# EAGLE schematic BalconyLight (EAGLE 9.3.1)

## Sheet 1 of 4
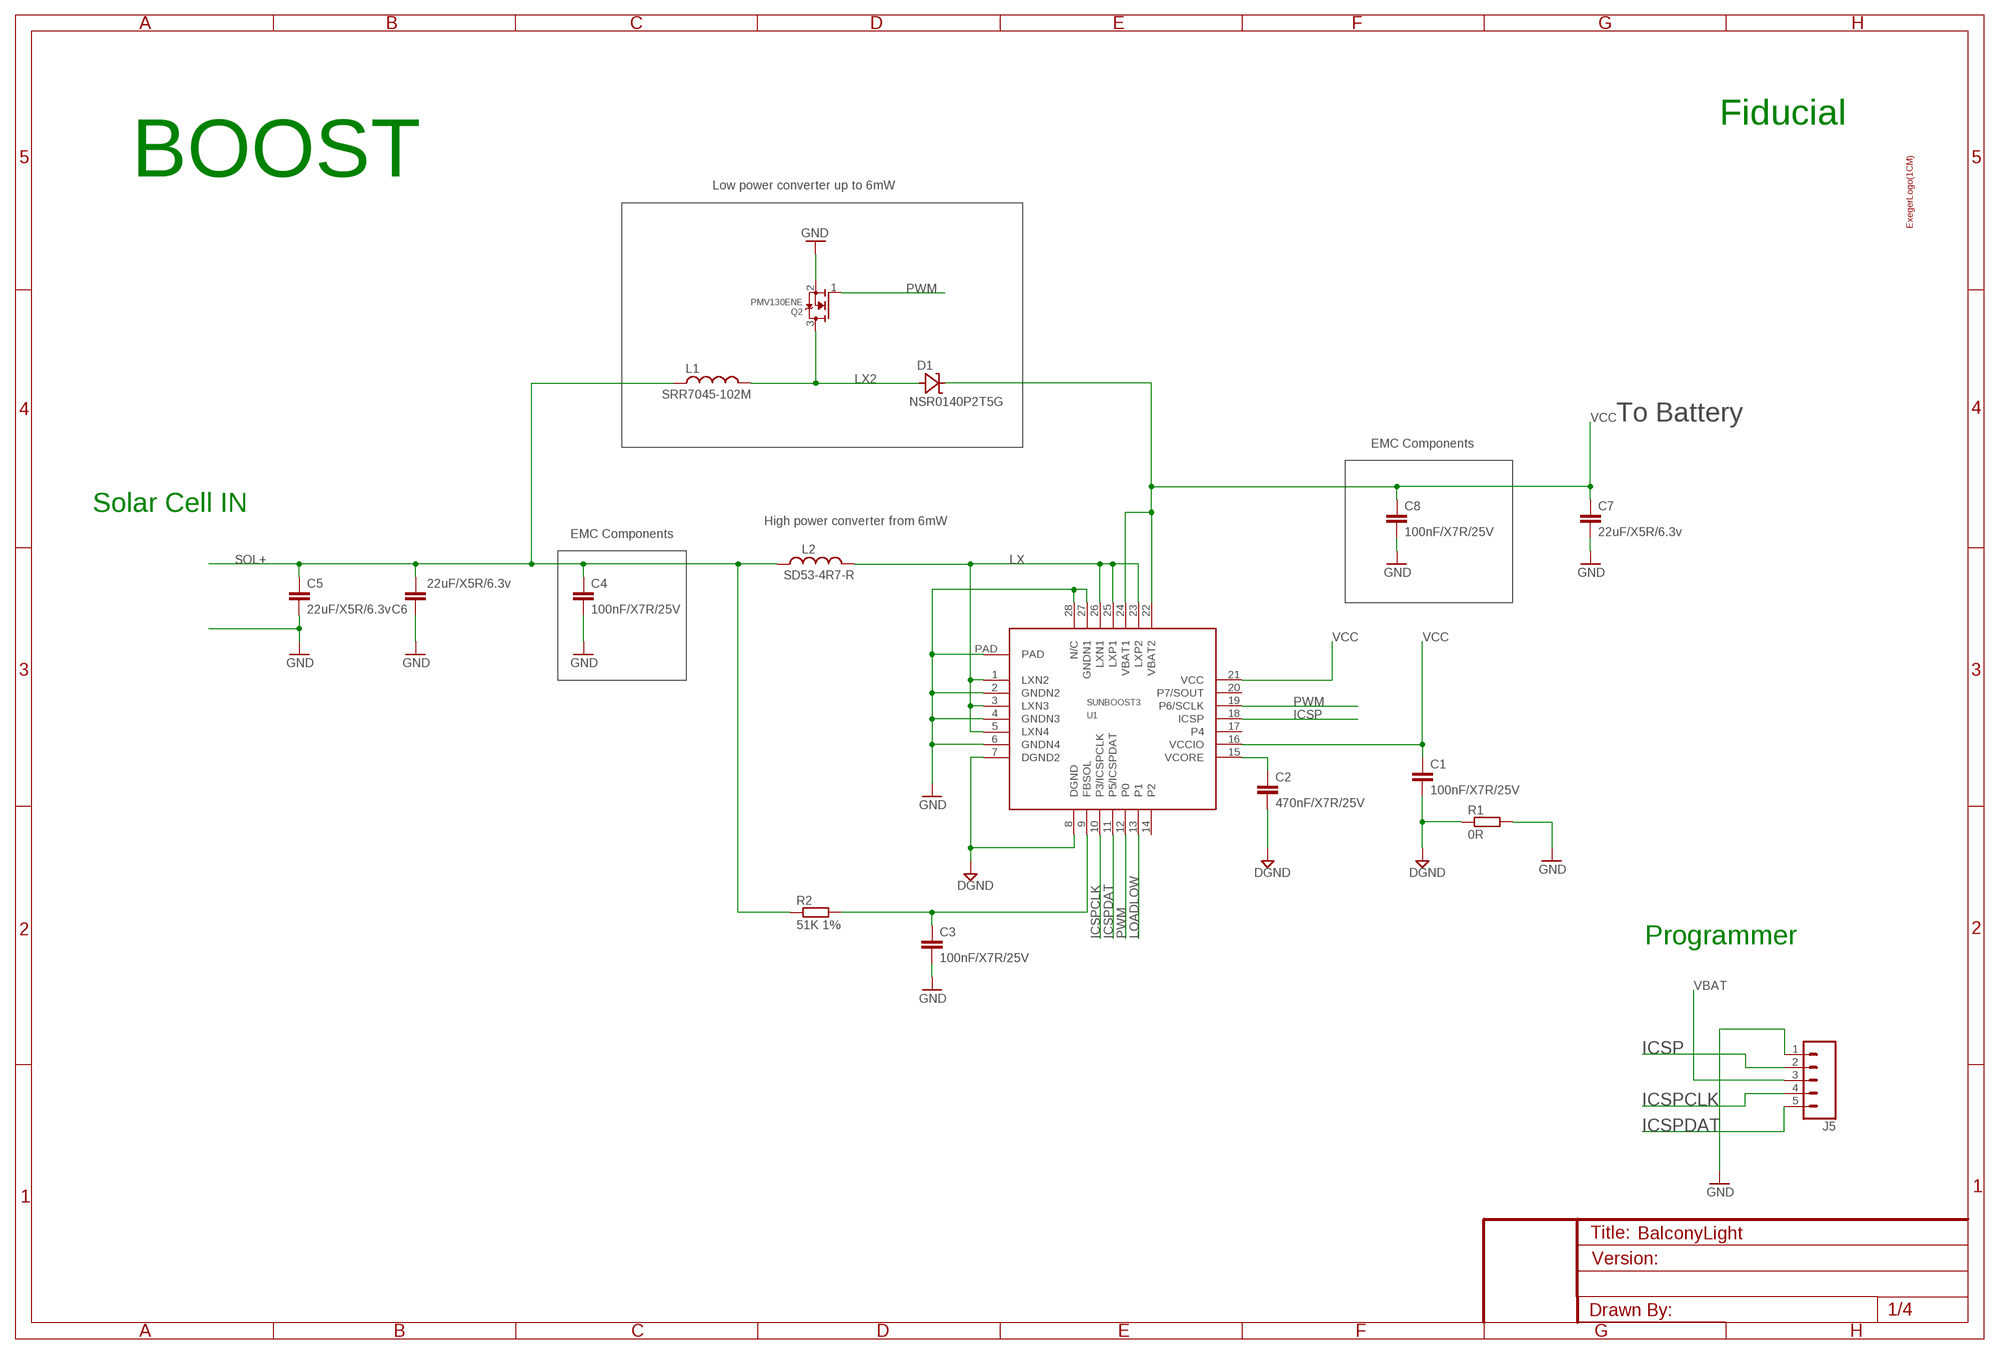
[diagram p0: schematic, sheet 1]

### Parts
C1  100nF/X7R/25V  C-EUC0402  [C0402]
C2  470nF/X7R/25V  C-EUC0402  [C0402]
C3  100nF/X7R/25V  C-EUC0402  [C0402]
C4  100nF/X7R/25V  C-EUC0402  [C0402]
C5  22uF/X5R/6.3v  C-EUC0805  [C0805]
C6  22uF/X5R/6.3v  C-EUC0805  [C0805]
C7  22uF/X5R/6.3v  C-EUC0805  [C0805]
C8  100nF/X7R/25V  C-EUC0402  [C0402]
D1  NSR0140P2T5G  [SODFL1006X40N]
J5  CONN_05LOCK  [1X05_LOCK]
L1  SRR7045-102M  [SRR7045]
L2  SD53-4R7-R  [SD53]
Q2  PMV130ENE  MOSFET-NREFLOW  [SOT23]
R1  0R  R-EU_R0402  [R0402]
R2  51K 1%  R-EU_R0402  [R0402]
U1  SUNBOOST3  [QFN-28-4X4]
U$13  EXEGER_LOGO_1CM  [EXEGER_LOGO_1CM]

### Nets
DGND: C1.2 C2.2 R1.1 U1.7(DGND2) U1.8(DGND)
GND: C3.2 C4.2 C5.2 C6.1 C7.2 C8.2 J5.1 Q2.2(S) R1.2 U1.2(GNDN2) U1.4(GNDN3) U1.6(GNDN4) U1.27(GNDN1) U1.28(N/C) U1.PAD ; also sheet 2,3,4
ICSP: J5.2 U1.18(ICSP)
ICSPCLK: J5.4 U1.10(P3/ICSPCLK)
ICSPDAT: J5.5 U1.11(P5/ICSPDAT)
LOADLOW: U1.13(P1)
LX: L2.2 U1.1(LXN2) U1.3(LXN3) U1.5(LXN4) U1.23(LXP2) U1.25(LXP1) U1.26(LXN1)
LX2: D1.2(A) L1.2 Q2.3(D)
N$1: C2.1 U1.15(VCORE)
N$4: C3.1 R2.2 U1.9(FBSOL)
PWM: Q2.1(G) U1.12(P0) U1.19(P6/SCLK)
SOL+: C4.1 C5.1 C6.2 L1.1 L2.1 R2.1
VBAT: J5.3 ; also sheet 2,3,4
VCC: C1.1 C7.1 C8.1 D1.1(C) U1.16(VCCIO) U1.21(VCC) U1.22(VBAT2) U1.24(VBAT1) ; also sheet 3
Unconnected: U1.14(P2) U1.17(P4) U1.20(P7/SOUT)

### Notes on the sheet
- Fiducial
- BOOST
- Low power converter up to 6mW
- To Battery
- EMC Components
- Solar Cell IN
- High power converter from 6mW
- EMC Components
- Programmer

## Sheet 2 of 4
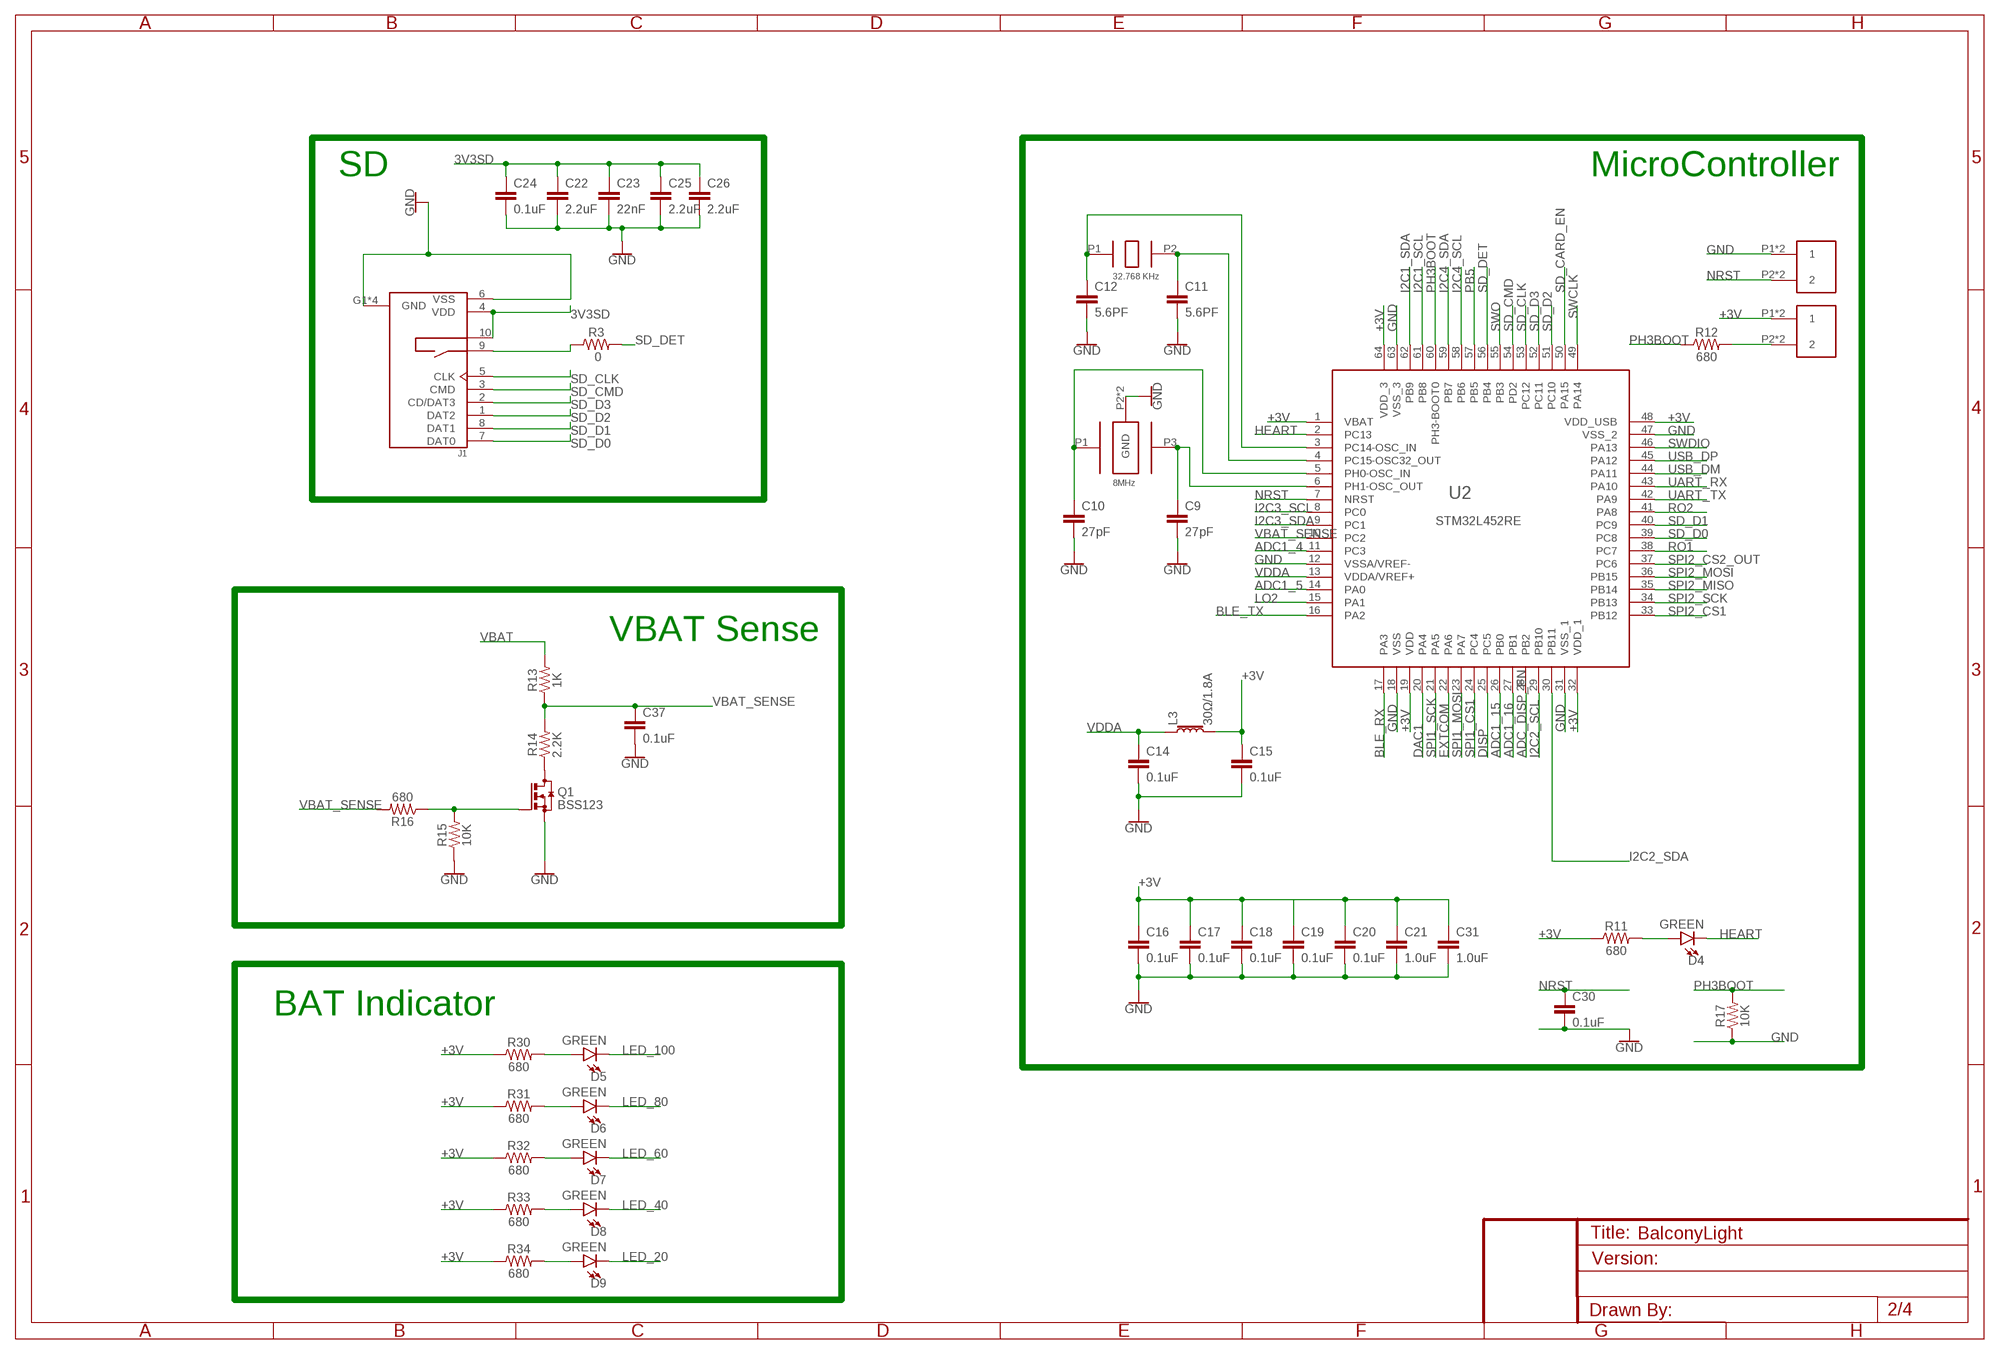
[diagram p1: schematic, sheet 2]

### Parts
C9  27pF  0.8PF-0402-50V-0.1PF  [0402]
C10  27pF  0.8PF-0402-50V-0.1PF  [0402]
C11  5.6PF  5.6PF-0603-50V-5%  [0603]
C12  5.6PF  5.6PF-0603-50V-5%  [0603]
C14  0.1uF  0.1UF-0402-16V-10%  [0402]
C15  0.1uF  0.1UF-0402-16V-10%  [0402]
C16  0.1uF  0.1UF-0402-16V-10%  [0402]
C17  0.1uF  0.1UF-0402-16V-10%  [0402]
C18  0.1uF  0.1UF-0402-16V-10%  [0402]
C19  0.1uF  0.1UF-0402-16V-10%  [0402]
C20  0.1uF  0.1UF-0402-16V-10%  [0402]
C21  1.0uF  1.0UF-0603-16V-10%  [0603]
C22  2.2uF  2.2UF-0603-10V-20%  [0603]
C23  22nF  22NF/22,000PF-0603-50V-10%  [0603]
C24  0.1uF  0.1UF-0603-25V-(+80/-20%)  [0603]
C25  2.2uF  2.2UF-0603-10V-20%  [0603]
C26  2.2uF  2.2UF-0603-10V-20%  [0603]
C30  0.1uF  0.1UF-0402-16V-10%  [0402]
C31  1.0uF  1.0UF-0603-16V-10%  [0603]
C37  0.1uF  0.1UF-0402-16V-10%  [0402]
D4  GREEN  LED-GREEN0603  [LED-0603]
D5  GREEN  LED-GREEN0603  [LED-0603]
D6  GREEN  LED-GREEN0603  [LED-0603]
D7  GREEN  LED-GREEN0603  [LED-0603]
D8  GREEN  LED-GREEN0603  [LED-0603]
D9  GREEN  LED-GREEN0603  [LED-0603]
J1  104031-0811  [MOLEX_104031-0811]
L3  30Ω/1.8A  FERRITE_BEAD-0603  [0603]
OSC1  OSC_32.768_KHZ  [OSC_32.768_KHZ]
Q1  BSS123  [SOT23]
R3  0  RESISTOR0402  [0402]
R11  680  100KOHM-0402-1/16W-1%  [0402]
R12  680  100KOHM-0402-1/16W-1%  [0402]
R13  1K  100KOHM-0402-1/16W-1%  [0402]
R14  2.2K  100KOHM-0402-1/16W-1%  [0402]
R15  10K  100KOHM-0402-1/16W-1%  [0402]
R16  680  100KOHM-0402-1/16W-1%  [0402]
R17  10K  100KOHM-0402-1/16W-1%  [0402]
R30  680  100KOHM-0402-1/16W-1%  [0402]
R31  680  100KOHM-0402-1/16W-1%  [0402]
R32  680  100KOHM-0402-1/16W-1%  [0402]
R33  680  100KOHM-0402-1/16W-1%  [0402]
R34  680  100KOHM-0402-1/16W-1%  [0402]
S1  EVQ-P7J  [EVQ-P7J]
S2  EVQ-P7J  [EVQ-P7J]
U2  STM32L452RE  [TQFP64]
U$2  OSC_8_MHZ  [OSC_8_MHZ]

### Nets
3V3SD: C22.1 C23.1 C24.1 C25.1 C26.1 J1.4(VDD) J1.10(CARD_DET2) ; also sheet 3
+3V: C15.1 C16.1 C17.1 C18.1 C19.1 C20.1 C21.1 C31.1 L3.2 R11.1 R30.1 R31.1 R32.1 R33.1 R34.1 S2.P1 S2.P4 U2.1(VBAT) U2.19(VDD) U2.32(VDD_1) U2.48(VDD_USB) U2.64(VDD_3) ; also sheet 3
ADC1_4: U2.11(PC3)
ADC1_5: U2.14(PA0)
ADC1_15: U2.26(PB0)
ADC1_16: U2.27(PB1)
ADC_DISP_EN: U2.28(PB2)
BLE_RX: U2.17(PA3) ; also sheet 4
BLE_TX: U2.16(PA2) ; also sheet 4
DAC1: U2.20(PA4)
DISP: U2.25(PC5)
EXTCOM: U2.22(PA6)
GND: C9.2 C10.2 C11.2 C12.2 C14.2 C15.2 C16.2 C17.2 C18.2 C19.2 C20.2 C21.2 C22.2 C23.2 C24.2 C25.2 C26.2 C30.2 C31.2 C37.2 J1.6(VSS) J1.G1(GND) J1.G2(GND) J1.G3(GND) J1.G4(GND) Q1.2(S) R15.1 R17.1 S1.P1 S1.P4 U2.12(VSSA/VREF-) U2.18(VSS) U2.31(VSS_1) U2.47(VSS_2) U2.63(VSS_3) U$2.P2(GND) U$2.P4(GND) ; also sheet 1,3,4
HEART: D4.C U2.2(PC13)
I2C1_SCL: U2.61(PB8) ; also sheet 4
I2C1_SDA: U2.62(PB9) ; also sheet 4
I2C2_SCL: U2.29(PB10)
I2C2_SDA: U2.30(PB11)
I2C3_SCL: U2.8(PC0)
I2C3_SDA: U2.9(PC1)
I2C4_SCL: U2.58(PB6) ; also sheet 3
I2C4_SDA: U2.59(PB7) ; also sheet 3
LED_20: D9.C
LED_40: D8.C
LED_60: D7.C
LED_80: D6.C
LED_100: D5.C
LO2: U2.15(PA1)
N$2: C12.1 OSC1.P1 U2.3(PC14-OSC_IN)
N$3: C11.1 OSC1.P2 U2.4(PC15-OSC32_OUT)
N$6: J1.9(CARD_DET1) R3.1
N$8: C9.1 U2.6(PH1-OSC_OUT) U$2.P3
N$13: C10.1 U2.5(PH0-OSC_IN) U$2.P1
N$14: D5.A R30.2
N$15: D6.A R31.2
N$18: D7.A R32.2
N$22: R12.2 S2.P2 S2.P3
N$23: D8.A R33.2
N$25: Q1.3(D) R14.1
N$26: D4.A R11.2
N$27: D9.A R34.2
N$29: Q1.1(G) R15.2 R16.1
NRST: C30.1 S1.P2 S1.P3 U2.7(NRST)
PB5: U2.57(PB5)
PH3BOOT: R12.1 R17.2 U2.60(PH3-BOOT0)
RO1: U2.38(PC7)
RO2: U2.41(PA8)
SD_CARD_EN: U2.50(PA15) ; also sheet 3
SD_CLK: J1.5(CLK) U2.53(PC12)
SD_CMD: J1.3(CMD) U2.54(PD2)
SD_D0: J1.7(DAT0) U2.39(PC8)
SD_D1: J1.8(DAT1) U2.40(PC9)
SD_D2: J1.1(DAT2) U2.51(PC10)
SD_D3: J1.2(CD/DAT3) U2.52(PC11)
SD_DET: R3.2 U2.56(PB4)
SPI1_CS1: U2.24(PC4)
SPI1_MOSI: U2.23(PA7)
SPI1_SCK: U2.21(PA5)
SPI2_CS1: U2.33(PB12)
SPI2_CS2_OUT: U2.37(PC6)
SPI2_MISO: U2.35(PB14)
SPI2_MOSI: U2.36(PB15)
SPI2_SCK: U2.34(PB13)
SWCLK: U2.49(PA14)
SWDIO: U2.46(PA13)
SWO: U2.55(PB3)
UART_RX: U2.43(PA10)
UART_TX: U2.42(PA9)
USB_DM: U2.44(PA11)
USB_DP: U2.45(PA12)
VBAT: R13.2 ; also sheet 1,3,4
VBAT_SENSE: C37.1 R13.1 R14.2 R16.2 U2.10(PC2)
VDDA: C14.1 L3.1 U2.13(VDDA/VREF+)

### Notes on the sheet
- SD | MicroController
- VBAT Sense
- BAT Indicator

## Sheet 3 of 4
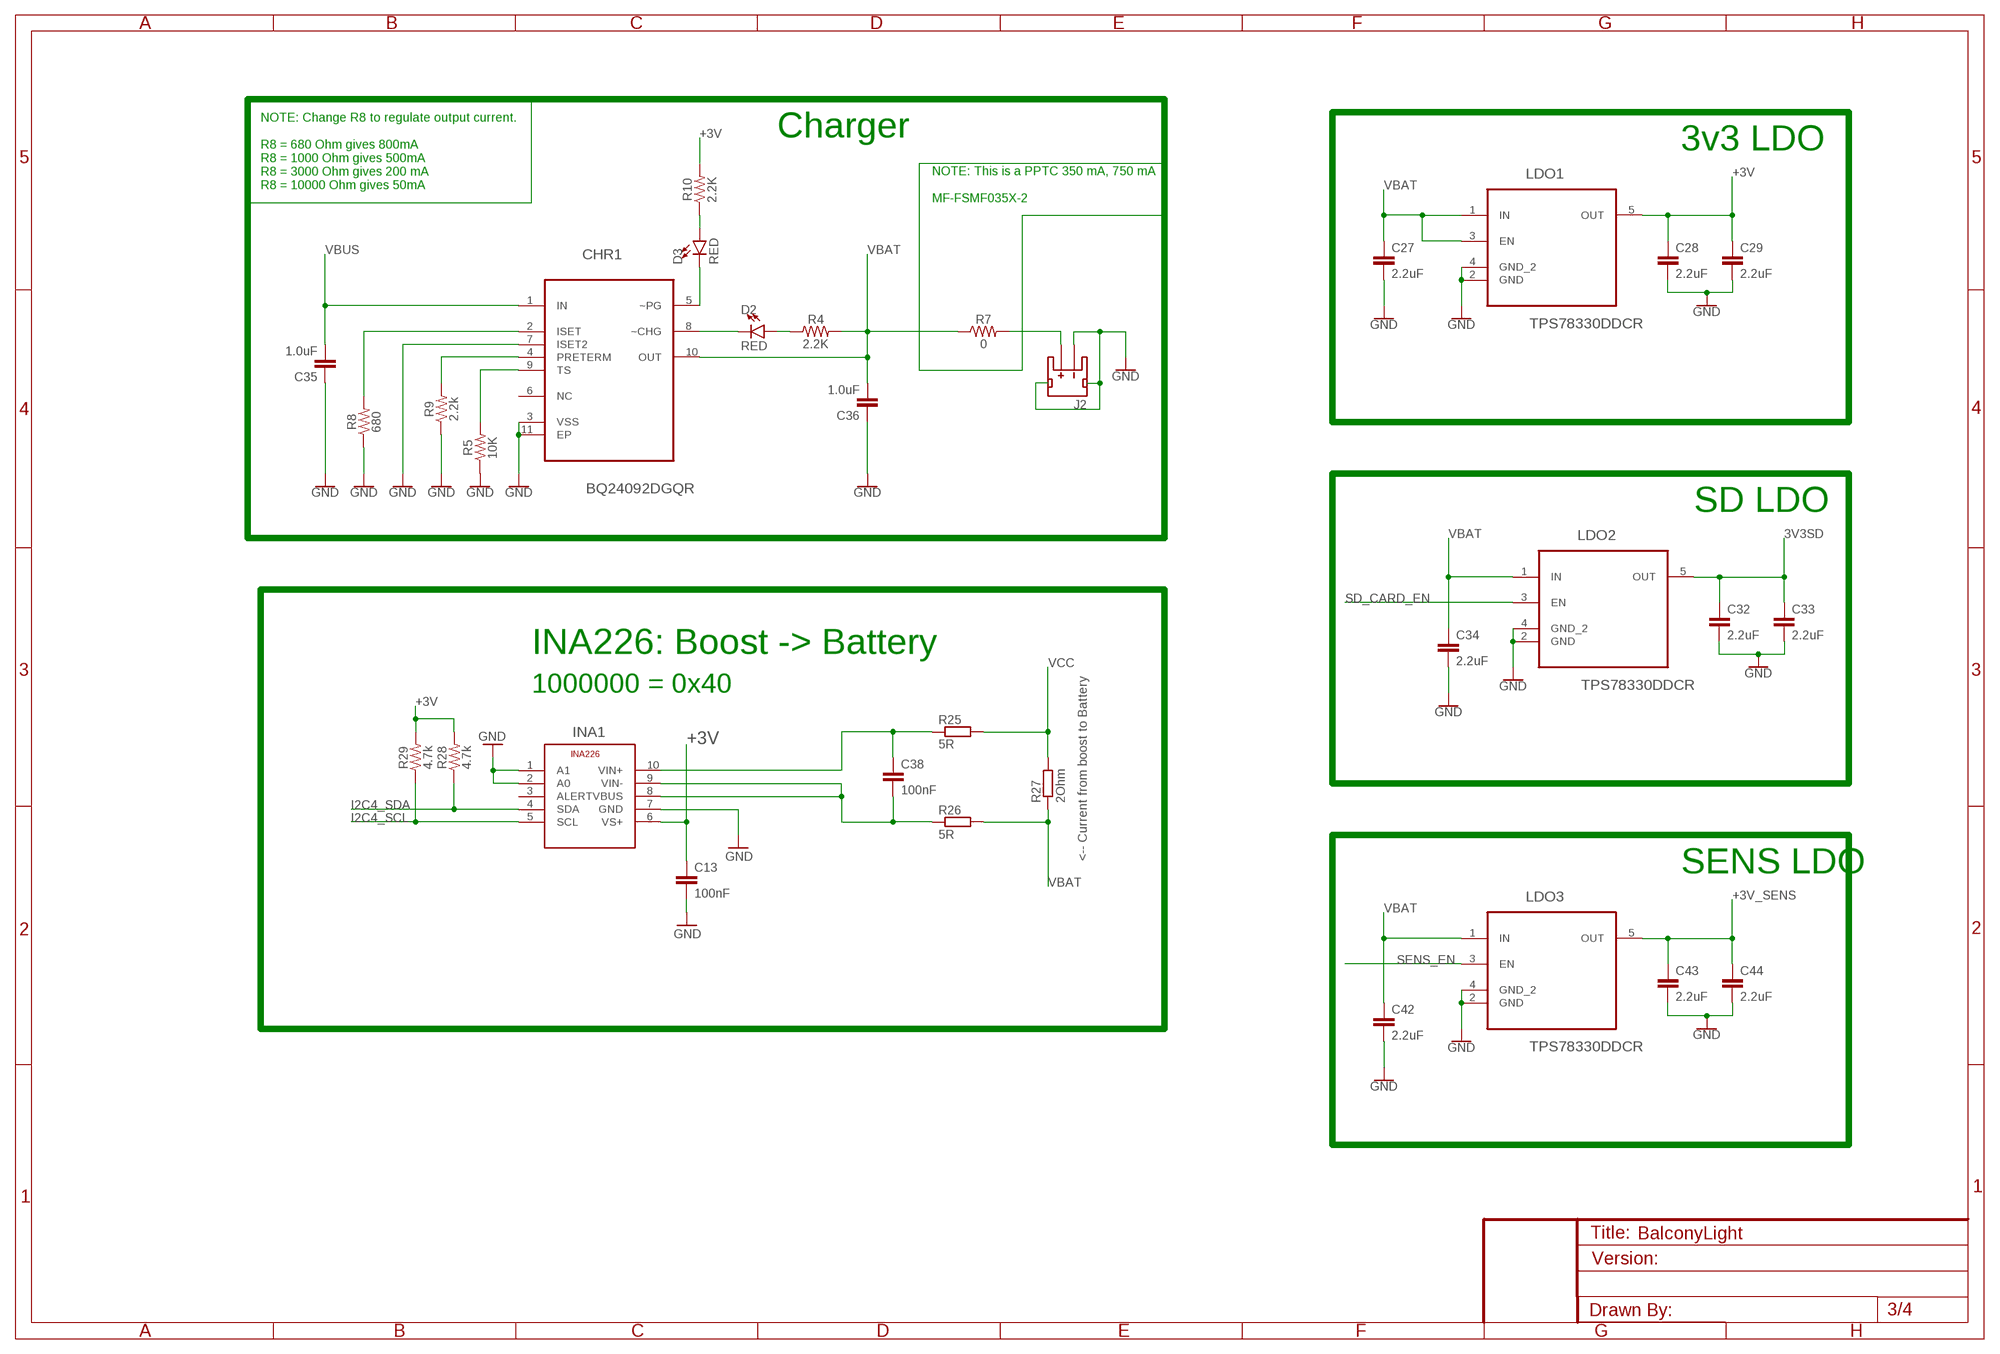
[diagram p2: schematic, sheet 3]

### Parts
C13  100nF  C-EUC0402  [C0402]
C27  2.2uF  2.2UF-0603-10V-20%  [0603]
C28  2.2uF  2.2UF-0603-10V-20%  [0603]
C29  2.2uF  2.2UF-0603-10V-20%  [0603]
C32  2.2uF  2.2UF-0603-10V-20%  [0603]
C33  2.2uF  2.2UF-0603-10V-20%  [0603]
C34  2.2uF  2.2UF-0603-10V-20%  [0603]
C35  1.0uF  1.0UF-0603-16V-10%  [0603]
C36  1.0uF  1.0UF-0603-16V-10%  [0603]
C38  100nF  C-EUC0402  [C0402]
C42  2.2uF  2.2UF-0603-10V-20%  [0603]
C43  2.2uF  2.2UF-0603-10V-20%  [0603]
C44  2.2uF  2.2UF-0603-10V-20%  [0603]
CHR1  BQ24092DGQR  [SOP50P490X110-11N]
D2  RED  LED-RED0603  [LED-0603]
D3  RED  LED-RED0603  [LED-0603]
INA1  TI-INA226  [TI-INA226]
J2  JST_2MM_MALE  [JST-2-SMD]
LDO1  TPS78330DDCR  [SOT95P280X110-5N]
LDO2  TPS78330DDCR  [SOT95P280X110-5N]
LDO3  TPS78330DDCR  [SOT95P280X110-5N]
R4  2.2K  100KOHM-0402-1/16W-1%  [0402]
R5  10K  100KOHM-0402-1/16W-1%  [0402]
R7  0  0OHM-0603-1/10W-5%  [0603]
R8  680  100KOHM-0402-1/16W-1%  [0402]
R9  2.2k  100KOHM-0402-1/16W-1%  [0402]
R10  2.2K  100KOHM-0402-1/16W-1%  [0402]
R25  5R  R-EU_R0402  [R0402]
R26  5R  R-EU_R0402  [R0402]
R27  2Ohm  R-EU_R0603  [R0603]
R28  4.7k  4.7KOHM-0603-1/10W-1%  [0603]
R29  4.7k  4.7KOHM-0603-1/10W-1%  [0603]

### Nets
3V3SD: C32.1 C33.1 LDO2.5(OUT) ; also sheet 2
+3V: C13.1 C28.1 C29.1 INA1.6(VS+) LDO1.5(OUT) R10.2 R28.2 R29.2 ; also sheet 2
+3V_SENS: C43.1 C44.1 LDO3.5(OUT) ; also sheet 4
GND: C13.2 C27.2 C28.2 C29.2 C32.2 C33.2 C34.2 C35.1 C36.1 C42.2 C43.2 C44.2 CHR1.3(VSS) CHR1.7(ISET2) CHR1.11(EP) INA1.1(A1) INA1.2(A0) INA1.7(GND) J2.1(-) J2.NC1(PAD1) J2.NC2(PAD2) LDO1.2(GND) LDO1.4(GND_2) LDO2.2(GND) LDO2.4(GND_2) LDO3.2(GND) LDO3.4(GND_2) R5.1 R8.1 R9.1 ; also sheet 1,2,4
I2C4_SCL: INA1.5(SCL) R29.1 ; also sheet 2
I2C4_SDA: INA1.4(SDA) R28.1 ; also sheet 2
N$12: CHR1.9(TS) R5.2
N$16: CHR1.2(ISET) R8.2
N$17: J2.2(+) R7.2
N$19: CHR1.4(PRETERM) R9.2
N$20: D3.A R10.1
N$21: CHR1.5(~PG) D3.C
N$104: D2.A R4.1
N$105: CHR1.8(~CHG) D2.C
SD_CARD_EN: LDO2.3(EN) ; also sheet 2
SENS_EN: LDO3.3(EN)
VBAT: C27.1 C34.1 C36.2 C42.1 CHR1.10(OUT) LDO1.1(IN) LDO1.3(EN) LDO2.1(IN) LDO3.1(IN) R4.2 R7.1 R26.2 R27.1 ; also sheet 1,2,4
VBAT1: C38.2 INA1.8(VBUS) INA1.9(VIN-) R26.1
VBUS: C35.2 CHR1.1(IN)
VCC: R25.2 R27.2 ; also sheet 1
VCC1: C38.1 INA1.10(VIN+) R25.1
Unconnected: CHR1.6(NC) INA1.3(ALERT)

### Notes on the sheet
- Charger
- 3v3 LDO
- NOTE: Change R8 to regulate output current.
  
  R8 = 680 Ohm gives 800mA
  R8 = 1000 Ohm gives 500mA
  R8 = 3000 Ohm gives 200 mA 
  R8 = 10000 Ohm gives 50mA
- NOTE: This is a PPTC 350 mA, 750 mA
  
  MF-FSMF035X-2
- SD LDO
- INA226: Boost -> Battery
- 1000000 = 0x40
- <-- Current from boost to Battery
- SENS LDO

## Sheet 4 of 4
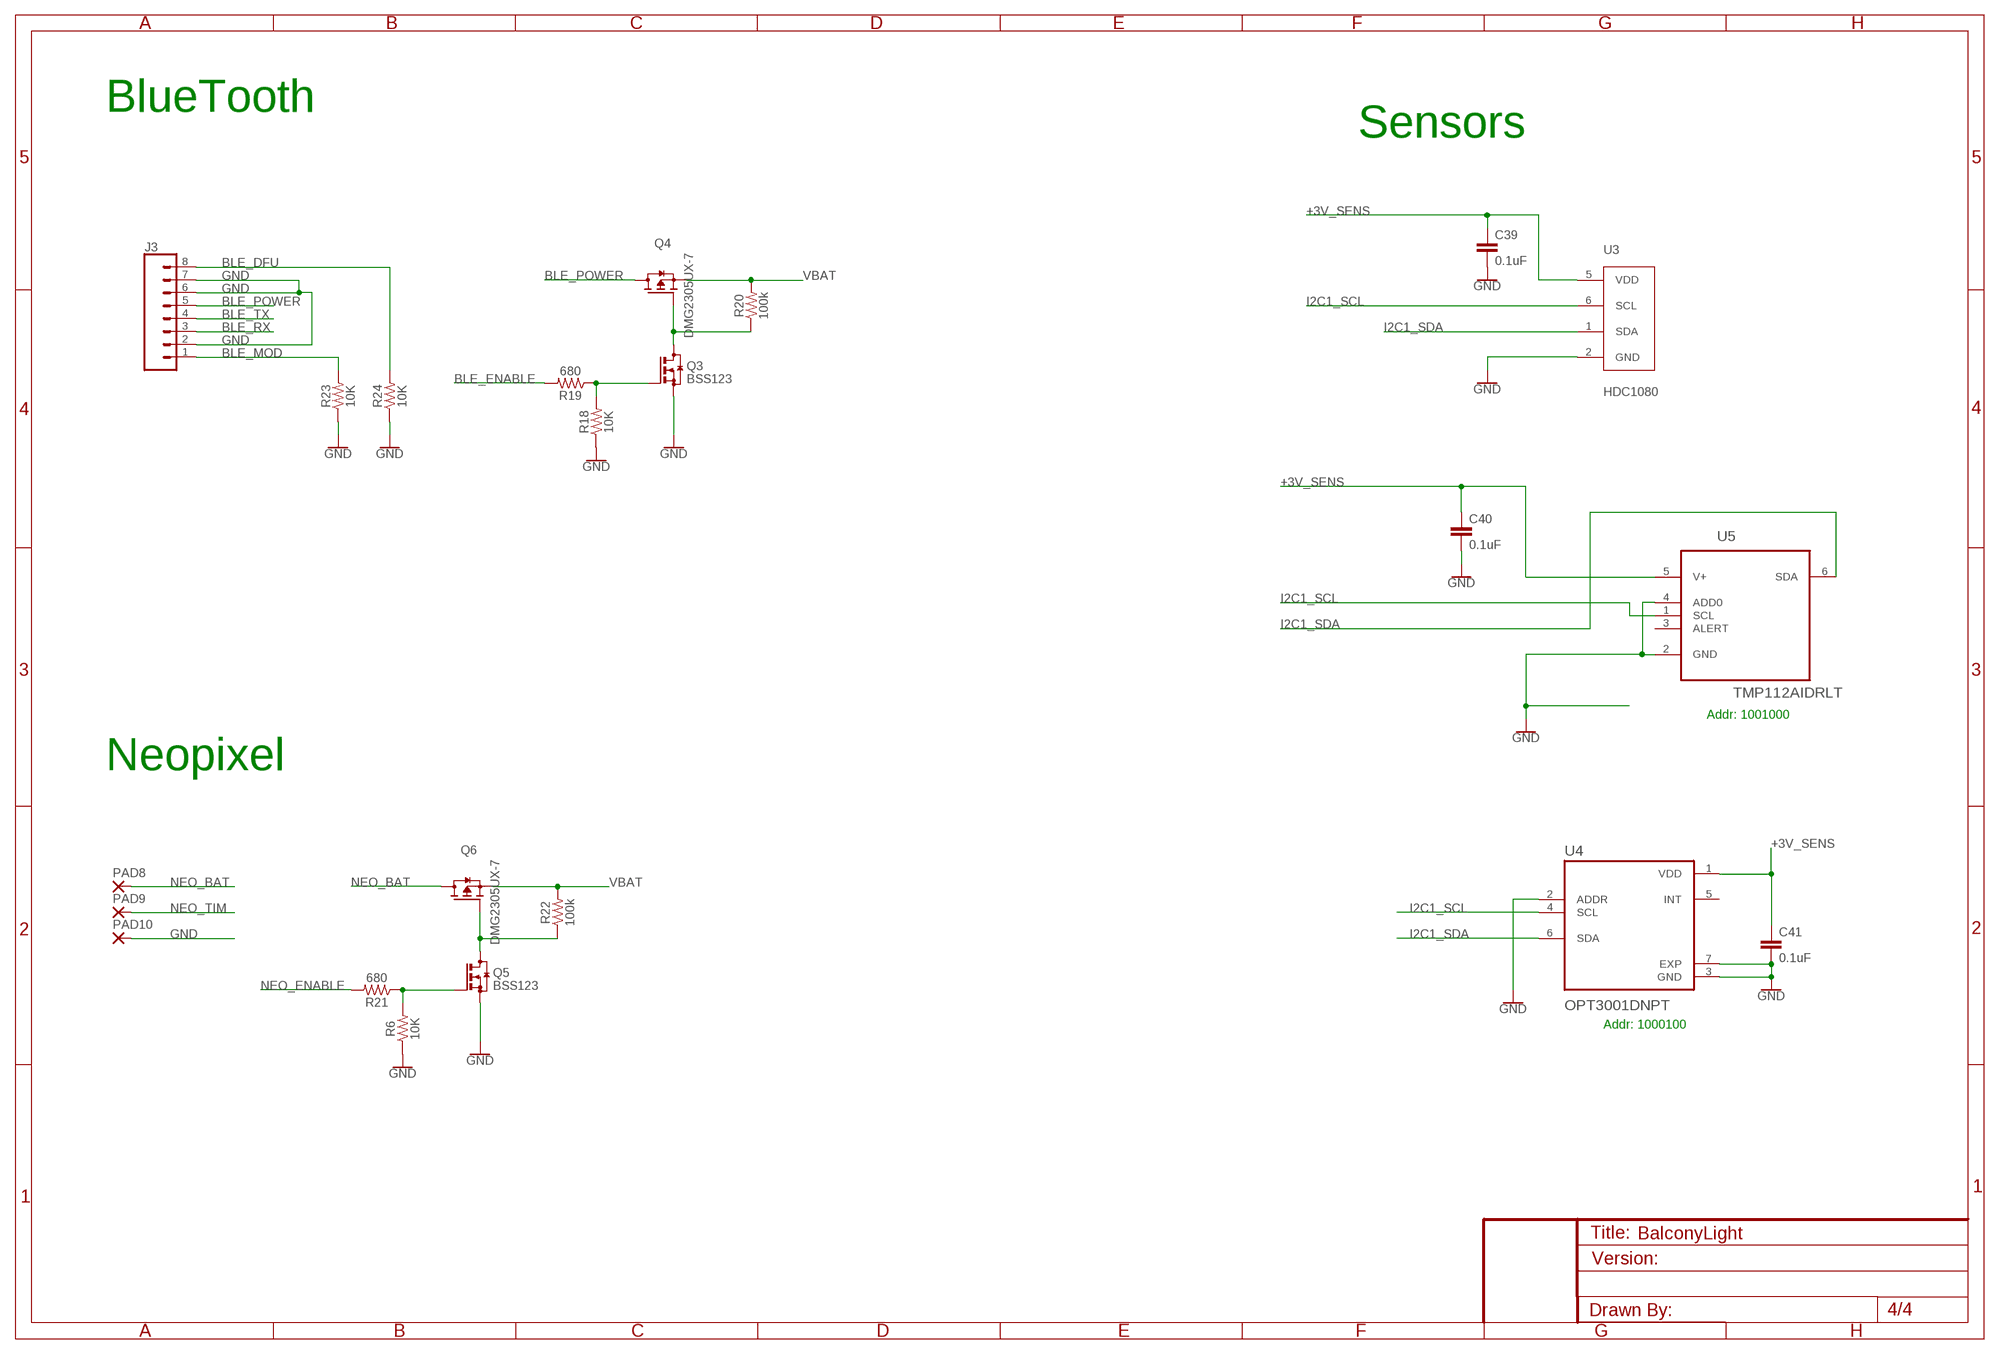
[diagram p3: schematic, sheet 4]

### Parts
C39  0.1uF  0.1UF-0603-25V-(+80/-20%)  [0603]
C40  0.1uF  0.1UF-0603-25V-(+80/-20%)  [0603]
C41  0.1uF  0.1UF-0603-25V-(+80/-20%)  [0603]
J3  CONN_08FEMALE_LOCK  [1X08_FEMALE_LOCK]
PAD8  SMD5  [SMD2,54-5,08]
PAD9  SMD5  [SMD2,54-5,08]
PAD10  SMD5  [SMD2,54-5,08]
Q3  BSS123  [SOT23]
Q4  DMG2305UX-7  [SOT91P240X110-3N_DMG2305UX-7]
Q5  BSS123  [SOT23]
Q6  DMG2305UX-7  [SOT91P240X110-3N_DMG2305UX-7]
R6  10K  100KOHM-0402-1/16W-1%  [0402]
R18  10K  100KOHM-0402-1/16W-1%  [0402]
R19  680  100KOHM-0402-1/16W-1%  [0402]
R20  100k  100KOHM-0603-1/10W-1%  [0603]
R21  680  100KOHM-0402-1/16W-1%  [0402]
R22  100k  100KOHM-0603-1/10W-1%  [0603]
R23  10K  100KOHM-0402-1/16W-1%  [0402]
R24  10K  100KOHM-0402-1/16W-1%  [0402]
U3  HDC1080  [HDC1080]
U4  OPT3001DNPT  [SON65P200X200X65-7N]
U5  TMP112AIDRLT  [SOT50P120X60-6N]

### Nets
+3V_SENS: C39.1 C40.1 C41.1 U3.5(VDD) U4.1(VDD) U5.5(V+) ; also sheet 3
BLE_DFU: J3.8 R24.2
BLE_ENABLE: R19.2
BLE_MOD: J3.1 R23.2
BLE_POWER: J3.5 Q4.3(D)
BLE_RX: J3.3 ; also sheet 2
BLE_TX: J3.4 ; also sheet 2
GND: C39.2 C40.2 C41.2 J3.2 J3.6 J3.7 PAD10.1(P) Q3.2(S) Q5.2(S) R6.1 R18.1 R23.1 R24.1 U3.2(GND) U4.2(ADDR) U4.3(GND) U4.7(EXP) U5.2(GND) U5.4(ADD0) ; also sheet 1,2,3
I2C1_SCL: U3.6(SCL) U4.4(SCL) U5.1(SCL) ; also sheet 2
I2C1_SDA: U3.1(SDA) U4.6(SDA) U5.6(SDA) ; also sheet 2
N$9: Q5.1(G) R6.2 R21.1
N$10: Q5.3(D) Q6.1(G) R22.1
N$31: Q3.1(G) R18.2 R19.1
N$32: Q3.3(D) Q4.1(G) R20.1
NEO_BAT: PAD8.1(P) Q6.3(D)
NEO_ENABLE: R21.2
NEO_TIM: PAD9.1(P)
VBAT: Q4.2(S) Q6.2(S) R20.2 R22.2 ; also sheet 1,2,3
Unconnected: U4.5(INT) U5.3(ALERT)

### Notes on the sheet
- BlueTooth
- Sensors
- Addr: 1001000
- Neopixel
- Addr: 1000100

## Library data of the parts
C1-C8 C13 C38 = rcl:C-EU: CAPACITOR, European symbol; SPICEPREFIX: C
C9 C10 = SparkFun-Capacitors:0.8PF: 0.8pF ceramic capacitors A capacitor is a passive two-terminal electrical component used to store electrical energy temporarily in an electric field.; PROD_ID: CAP-13456; VALUE: 0.8pF
C11 C12 = SparkFun-Capacitors:5.6PF: 5.6pF ceramic capacitors A capacitor is a passive two-terminal electrical component used to store electrical energy temporarily in an electric field.; PROD_ID: CAP-12456
C14-C20 C30 C37 = SparkFun-Capacitors:0.1UF: 0.1µF ceramic capacitors A capacitor is a passive two-terminal electrical component used to store electrical energy temporarily in an electric field.; PROD_ID: CAP-12416
C21 C31 C35 C36 = SparkFun-Capacitors:1.0UF: 1µF ceramic capacitors A capacitor is a passive two-terminal electrical component used to store electrical energy temporarily in an electric field.; PROD_ID: CAP-00868
C22 C25-C29 C32-C34 C42-C44 = SparkFun-Capacitors:2.2UF: 2.2µF ceramic capacitors A capacitor is a passive two-terminal electrical component used to store electrical energy temporarily in an electric field.; PROD_ID: CAP-07888
C23 = SparkFun-Capacitors:22NF/22,000PF: 0.022uF/22nF/22,000pF ceramic capacitors A capacitor is a passive two-terminal electrical component used to store electrical energy temporarily in an electric field.; PROD_ID: CAP-07885
C24 C39-C41 = SparkFun-Capacitors:0.1UF: 0.1µF ceramic capacitors A capacitor is a passive two-terminal electrical component used to store electrical energy temporarily in an electric field.; PROD_ID: CAP-00810
CHR1 = GeneralLogger:BQ24092DGQR: 1A, Single-Input, Single Cell Li-Ion Battery Charger; AVAILABILITY: Unavailable; DESCRIPTION: 1A, Single-Input, Single-Cell Li-Ion Battery Charger with Operation Over JEITA and 10kO NTC 10-MSOP-PowerPAD -40 to 150; MF: Texas Instruments; MP: BQ24092DGQR; PACKAGE: MSOP-10 Texas Instruments; PRICE: None
D1 = Dmag:NSR0140P2T5G
D2 D3 = SparkFun-LED:LED-RED: Red SMD LED Used in manufacturing of most products at SparkFun Packages: 0603 - SMD 0603 package [Product Link] <http://docs.avagotech.com/docs/AV02-0551EN> 0603 SMART - SMD 0603 SMART package ( more efficient and expensive)[Product Link] <http://www.osram-os.com/Graphics/XPic2/00077099_0.pdf> 1206 - SMD1206 package [Product Link] <https://www.sparkfun.com/datasheets/DevTools/LilyPad/Q150OVS4.pdff> SparkFun Products: Pro Mini 328 -5V <https://www.sparkfun.com/products/821> RedBoard <https://www.sparkfun.com/products/12757> IOIO-OTG <https://www.sparkfun.com/products/13613>; PROD_ID: DIO-00819
D4-D9 = SparkFun-LED:LED-GREEN: Green SMD LED Used in manufacturing of various products at SparkFun Packages: 0603 - SMD 0603 package [Product Link] <http://www.futureelectronics.com/en/technologies/semiconductors/optoelectronics/leds/Pages/9894312-LTST-C190GKT.aspx?CrossPart=HSMG-C190&IM=0> LilyPad 1206 - SMD1206 LilyPad package [Product Link] <http://www.futureelectronics.com/en/Technologies/Product.aspx?ProductID=IN150NGHARVATEKCORPORATION2049943&IM=0> 1206 - SMD1206 package [Product Link] <http://www.futureelectronics.com/en/technologies/semiconductors/optoelectronics/leds/Pages/8315665-LTST-C150KGKT.aspx?IM=0> 1206 Bottom Mount -SMD 1206 Bottom Mount [Product Link] <http://www.digikey.com/product-detail/en/lite-on-inc/LTST-C230KGKT/160-1456-1-ND/386854> SparkFun Products: Pro Mini 328 -5V <https://www.sparkfun.com/products/821> RedBoard <https://www.sparkfun.com/products/12757> MP3 Trigger <https://www.sparkfun.com/products/13720> Makey Makey <https://www.sparkfun.com/products/11076>; PROD_ID: DIO-00821
INA1 = FaBo-Mems:TI-INA226: Texus Instruments INA226(Power)
J1 = GeneralLogger:104031-0811: 1.10mm Pitch microSD Memory Card Connector, SMT, Push-Pull Type, 1.42mm Height, with Detect Switch; AVAILABILITY: Unavailable; DESCRIPTION: 1.10mm Pitch microSD Memory Card Connector, SMT, Push-Pull Type, 1.42mm Height, with Detect Switch; MF: Molex, LLC; MP: 104031-0811; PACKAGE: None; PRICE: None
J2 = SparkFun-Connectors:JST_2MM_MALE: JST 2MM MALE RA CONNECTOR Two pin, compact surface mount connector. Commonly used as a battery input connection point. We really like the solid locking feeling and high current rating on these small connectors. We use these all the time as battery connectors. Mates to single-cell LiPo batteries. Here is the connector we sell at SparkFun: JST Right Angle Connector - White <https://www.sparkfun.com/products/8612> (PRT-08612) Datasheet <http://www.sparkfun.com/datasheets/Prototyping/Connectors/JST-Horizontal.pdf> It was used on these SparkFun products: SparkFun MOSFET Power Controller <https://www.sparkfun.com/products/11214> (PRT-11214) SparkFun Battery Babysitter - LiPo Battery Manager <https://www.sparkfun.com/products/13777> (PRT-13777) And many, many others that required a lipo battery connection.; PROD_ID: CONN-11443; SF_ID: PRT-08612
J3 = SparkFun-Connectors:CONN_08: Multi connection point. Often used as Generic Header-pin footprint for 0.1 inch spaced/style header connections On any of the 0.1 inch spaced packages, you can populate with these: Break Away Headers - Straight <https://www.sparkfun.com/products/116> (PRT-00116) Break Away Male Headers - Right Angle <https://www.sparkfun.com/products/553> (PRT-00553) Female Headers <https://www.sparkfun.com/products/115> (PRT-00115) Break Away Headers - Machine Pin <https://www.sparkfun.com/products/117> (PRT-00117) Break Away Female Headers - Swiss Machine Pin <https://www.sparkfun.com/products/743> (PRT-00743) Arduino Stackable Header - 8 Pin <https://www.sparkfun.com/products/9279> (PRT-09279) For SCREWTERMINALS and SPRING TERMINALS visit here: Screw Terimnals on SparkFun.com <https://www.sparkfun.com/search/results?term=Screw+Terminals> (5mm/3.5mm/2.54mm spacing) This device is also useful as a general connection point to wire up your design to another part of your project. Our various solder wires solder well into these plated through hole pads. Hook-Up Wire - Assortment (Stranded, 22 AWG) <https://www.sparkfun.com/products/11375> (PRT-11375) Hook-Up Wire - Assortment (Solid Core, 22 AWG) <https://www.sparkfun.com/products/11367> (PRT-11367) View the entire wire category on our website here <https://www.sparkfun.com/categories/141> Special notes: Molex polarized connector foot print use with SKU : PRT-08231 with associated crimp pins and housings. 1MM SMD Version SKU: PRT-10208 NOTES ON THE VARIANTS LOCK and LOCK_LONGPADS... This footprint was designed to help hold the alignment of a through-hole component (i.e. 6-pin header) while soldering it into place. You may notice that each hole has been shifted either up or down by 0.005 of an inch from it's more standard position (which is a perfectly straight line). This slight alteration caused the pins (the squares in the middle) to touch the edges of the holes. Because they are alternating, it causes a "brace" to hold the component in place. 0.005 has proven to be the perfect amount of "off-center" position when using our standard breakaway headers. Although looks a little odd when you look at the bare footprint, once you have a header in there, the alteration is very hard to notice. Also,if you push a header all the way into place, it is covered up entirely on the bottom side.; PROD_ID: CONN-09233; SF_ID: PRT-09279
J5 = SparkFun-Connectors:CONN_05: Multi connection point. Often used as Generic Header-pin footprint for 0.1 inch spaced/style header connections On any of the 0.1 inch spaced packages, you can populate with these: Break Away Headers - Straight <https://www.sparkfun.com/products/116> (PRT-00116) Break Away Male Headers - Right Angle <https://www.sparkfun.com/products/553> (PRT-00553) Female Headers <https://www.sparkfun.com/products/115> (PRT-00115) Break Away Headers - Machine Pin <https://www.sparkfun.com/products/117> (PRT-00117) Break Away Female Headers - Swiss Machine Pin <https://www.sparkfun.com/products/743> (PRT-00743) For SCREWTERMINALS and SPRING TERMINALS visit here: Screw Terimnals on SparkFun.com <https://www.sparkfun.com/search/results?term=Screw+Terminals> (5mm/3.5mm/2.54mm spacing) This device is also useful as a general connection point to wire up your design to another part of your project. Our various solder wires solder well into these plated through hole pads. Hook-Up Wire - Assortment (Stranded, 22 AWG) <https://www.sparkfun.com/products/11375> (PRT-11375) Hook-Up Wire - Assortment (Solid Core, 22 AWG) <https://www.sparkfun.com/products/11367> (PRT-11367) View the entire wire category on our website here <https://www.sparkfun.com/categories/141> Special notes: Molex polarized connector foot print use with SKU : PRT-08231 with associated crimp pins and housings. 1MM SMD Version SKU: PRT-10208
L1 = Dmag:SRR7045-102M
L2 = Dmag:SD53-4R7-R
L3 = SparkFun-Coils:FERRITE_BEAD: Ferrite Bead (blocks, cores, rings, chokes, etc.) Inductor with layers of ferrite used to suppress high frequencies. Often used to isolate high frequency noise. SparkFun Products: IOIO-OTG - V2.2 <https://www.sparkfun.com/products/13613> SparkFun SAMD21 Mini Breakout <https://www.sparkfun.com/products/13664> SparkFun 6 Degrees of Freedom Breakout - LSM6DS3 <https://www.sparkfun.com/products/13339> SparkFun SAMD21 Dev Breakout <https://www.sparkfun.com/products/13672>; PROD_ID: NDUC-07859
LDO1-LDO3 = GeneralLogger:TPS78330DDCR: 500nA IQ, 150mA, Ultra-Low Quiescent Current Low-Dropout Linear Regulator; AVAILABILITY: Unavailable; DESCRIPTION: 500-nA IQ, 150-mA, Ultralow Quiescent Current Low-Dropout Linear Regulator 5-SOT -40 to 105; MF: Texas Instruments; MP: TPS78330DDCR; PACKAGE: SOT-23-5 Texas Instruments; PRICE: None
OSC1 = GeneralLogger:OSC_32.768_KHZ
PAD8-PAD10 = wirepad:SMD5: SMD PAD
Q1 Q3 Q5 = transistor-small-signal:BSS123: N-CHANNEL MOS FET
Q2 = adafruit:MOSFET-N: N-Channel Mosfet 2N7002E - 60V 260mA SOT23 [Digikey: 2N7002ET1GOSTR-ND] - REEL BSH103 - 30V 850mA SOT23 [Digikey: 568-5013-1-ND]
Q4 Q6 = DMG2305UX-7:DMG2305UX-7: DMG2305UX Series 20 V 65 Ohms P-Ch Enhancement Mode Mosfet - SOT-23-3; AVAILABILITY: Unavailable; DESCRIPTION: P-Channel 20V 4.2A _Ta_ 1.4W _Ta_ Surface Mount SOT-23; MF: Diodes Inc.; MP: DMG2305UX-7; PACKAGE: SOT-23-3 Diodes Inc.; PRICE: None
R1 R2 = resistor:R-EU_: RESISTOR, European symbol
R3 = SparkFun-Resistors:RESISTOR: Generic Resistor Package
R4-R6 R8-R19 R21 R23 R24 R30-R34 = SparkFun-Resistors:100KOHM: 100kΩ resistor A resistor is a passive two-terminal electrical component that implements electrical resistance as a circuit element. Resistors act to reduce current flow, and, at the same time, act to lower voltage levels within circuits. - Wikipedia; PROD_ID: RES-13495; VALUE: 100K
R7 = SparkFun-Resistors:0OHM: 0Ω resistor A resistor is a passive two-terminal electrical component that implements electrical resistance as a circuit element. Resistors act to reduce current flow, and, at the same time, act to lower voltage levels within circuits. - Wikipedia; PROD_ID: RES-08609
R20 R22 = SparkFun-Resistors:100KOHM: 100kΩ resistor A resistor is a passive two-terminal electrical component that implements electrical resistance as a circuit element. Resistors act to reduce current flow, and, at the same time, act to lower voltage levels within circuits. - Wikipedia; PROD_ID: RES-07828
R25-R27 = rcl:R-EU_: RESISTOR, European symbol; SPICEPREFIX: R
R28 R29 = SparkFun-Resistors:4.7KOHM: 4.7kΩ resistor A resistor is a passive two-terminal electrical component that implements electrical resistance as a circuit element. Resistors act to reduce current flow, and, at the same time, act to lower voltage levels within circuits. - Wikipedia; PROD_ID: RES-07857
S1 S2 = GeneralLogger:EVQ-P7J: EVQP7J Switch
U1 = Dmag:SUNBOOST3
U2 = GeneralLogger:STM32L452RE: • Ultra-low-power with FlexPowerControl – 1.71 V to 3.6 V power supply – -40 °C to 85/125 °C temperature range – 145 nA in VBAT mode: supply for RTC and 32x32-bit backup registers – 22 nA Shutdown mode (5 wakeup pins) – 106 nA Standby mode (5 wakeup pins) – 375 nA Standby mode with RTC – 2.05 µA Stop 2 mode, 2.40 µA with RTC – 84 µA/MHz run mode (LDO Mode) – 36 μA/MHz run mode (@3.3 V SMPS Mode) – Batch acquisition mode (BAM) – 4 µs wakeup from Stop mode – Brown out reset (BOR) – Interconnect matrix • Core: Arm® 32-bit Cortex®-M4 CPU with FPU, Adaptive real-time accelerator (ART Accelerator™) allowing 0-wait-state execution from Flash memory, frequency up to 80 MHz, MPU, 100DMIPS and DSP instructions • Performance benchmark – 1.25 DMIPS/MHz (Drystone 2.1) – 273.55 CoreMark® (3.42 CoreMark/MHz @ 80 MHz) • Energy benchmark – 335 ULPMark™ CP score – 104 ULPMark™ PP score • Clock Sources – 4 to 48 MHz crystal oscillator – 32 kHz crystal oscillator for RTC (LSE) – Internal 16 MHz factory-trimmed RC (±1%) – Internal low-power 32 kHz RC (±5%) – Internal multispeed 100 kHz to 48 MHz oscillator, auto-trimmed by LSE (better than ±0.25 % accuracy) – Internal 48 MHz with clock recovery – 2 PLLs for system clock, audio, ADC • Up to 83 fast I/Os, most 5 V-tolerant • RTC with HW calendar, alarms and calibration • Up to 21 capacitive sensing channels: support touchkey, linear and rotary touch sensors • 12x timers: 1x 16-bit advanced motor-control, 1x 32-bit and 3x 16-bit general purpose, 2x 16- bit basic, 2x low-power 16-bit timers (available in Stop mode), 2x watchdogs, SysTick timer • Memories – Up to 512 KB single bank Flash, proprietary code readout protection – 160 KB of SRAM including 32 KB with hardware parity check – Quad SPI memory interface • Rich analog peripherals (independent supply) – 1x 12-bit ADC 5 Msps, up to 16-bit with hardware oversampling, 200 µA/Msps – 1x 12-bit DAC output channels, low-power sample and hold – 1x operational amplifier with built-in PGA – 2x ultra-low-power comparators – Accurate 2.5 V or 2.048 V reference voltage buffered output • 17x communication interfaces – USB 2.0 full-speed crystal less solution with LPM and BCD – 1x SAI (serial audio interface) – 4x I2C FM+(1 Mbit/s), SMBus/PMBus – 3x USARTs (ISO 7816, LIN, IrDA, modem) – 1x UART (LIN, IrDA, modem) – 1x LPUART (Stop 2 wake-up) – 3x SPIs (and 1x Quad SPI) – CAN (2.0B Active) and SDMMC interface UFBGA100 (7×7) LQFP64 (10×10) UFBGA64 (5×5) LQFP100 (14×14) WLCSP64 UFQFPN48 (7×7) (3.36×3.66) www.st.com STM32L452xx 2/215 DS11912 Rev 5 – IRTIM (Infrared interface) • 14-channel DMA controller • True random number generator • CRC calculation unit, 96-bit unique ID • Development support: serial wire debug (SWD), JTAG, Embedded Trace Macrocell™ • All packages are ECOPACK2® compliant
U3 = GeneralLogger:HDC1080: HDC1080 Low Power, High Accuracy Digital Humidity Sensor with Temperature Sensor Part Number: HDC1080 Size: 3mm x 3mm Relative Humidity Accuracy ±2% (typical) Temperature Accuracy ±0.2°C (typical) Excellent Stability at High Humidity 14 Bit Measurement Resolution 100 nA Sleep Mode Current Average Supply Current: 710 nA @ 1sps, 11 bit RH Measurement 1.3 µA @ 1sps, 11 bit RH and Temperature Measurement Supply Voltage 2.7 V to 5.5 V Small 3 mm x 3 mm Device Footprint I2C Interface
U4 = OPT3001DNPT:OPT3001DNPT; AVAILABILITY: Unavailable; DESCRIPTION: Digital ambient light sensor (ALS) with high-precision human-eye response 6-USON -40 to 85; DIGIKEY-PURCHASE-URL: https://snapeda.com/shop?store=DigiKey&id=194366; MF: Texas Instruments; MOUSER-PURCHASE-URL: https://snapeda.com/shop?store=Mouser&id=194366; MP: OPT3001DNPT; PACKAGE: USON-6 Texas Instruments; PRICE: None; TEXAS_INSTRUMENTS-PURCHASE-URL: https://snapeda.com/shop?store=Texas+Instruments&id=194366
U5 = TMP112AIDRLT:TMP112AIDRLT: Digital Temperature Sensor; AVAILABILITY: Unavailable; DESCRIPTION: Temperature Sensor Digital, Local -40°C ~ 125°C 12 b SOT-563; MF: Texas Instruments; MP: TMP112AIDRLT; PACKAGE: SOT-563 Texas Instruments; PRICE: None
U$2 = GeneralLogger:OSC_8_MHZ: 7B-8.000MAAJ-T - 8 MHz oscillator
U$13 = RamuLib:EXEGER_LOGO_1CM: Exeger logo 1 cm diameter